# Altium schematic sheet Digital.SchDoc
size 840 x 594 mm
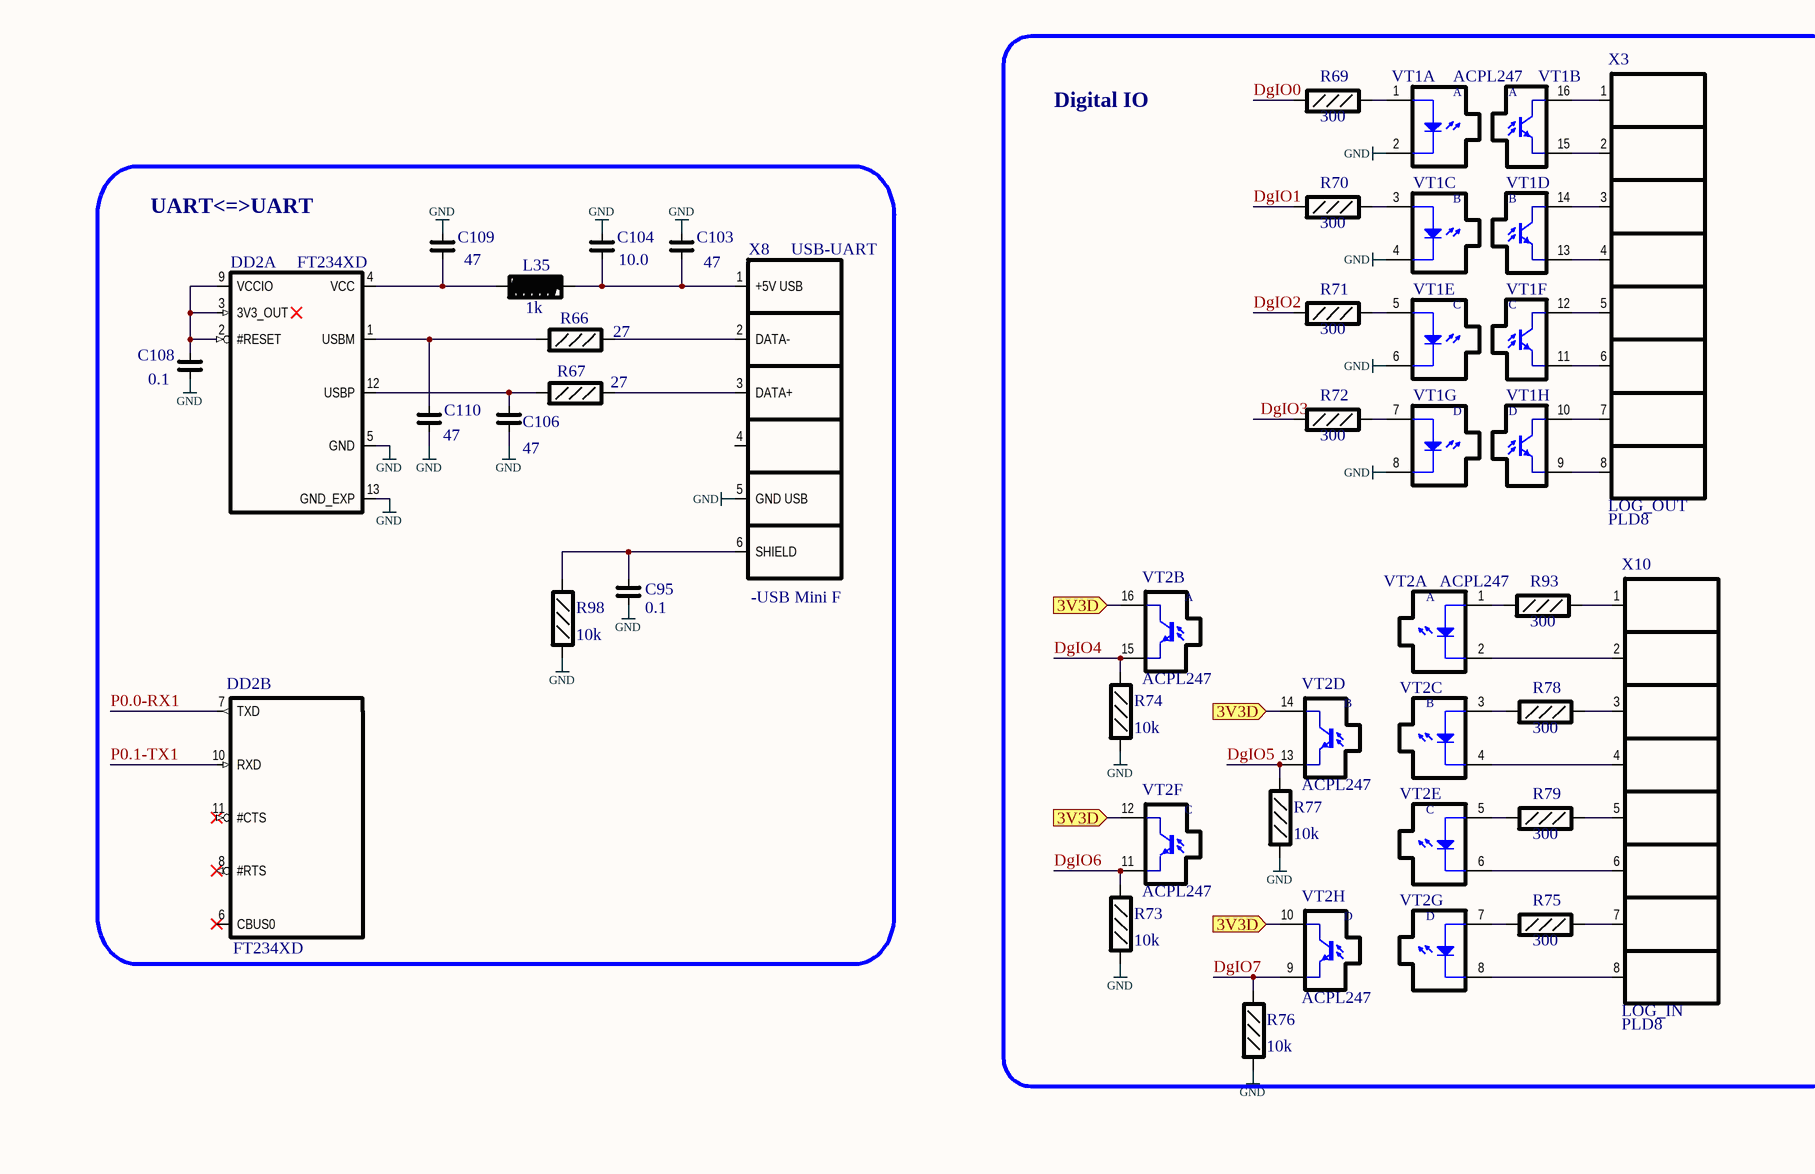
[diagram p0: Digital.SchDoc, top left]
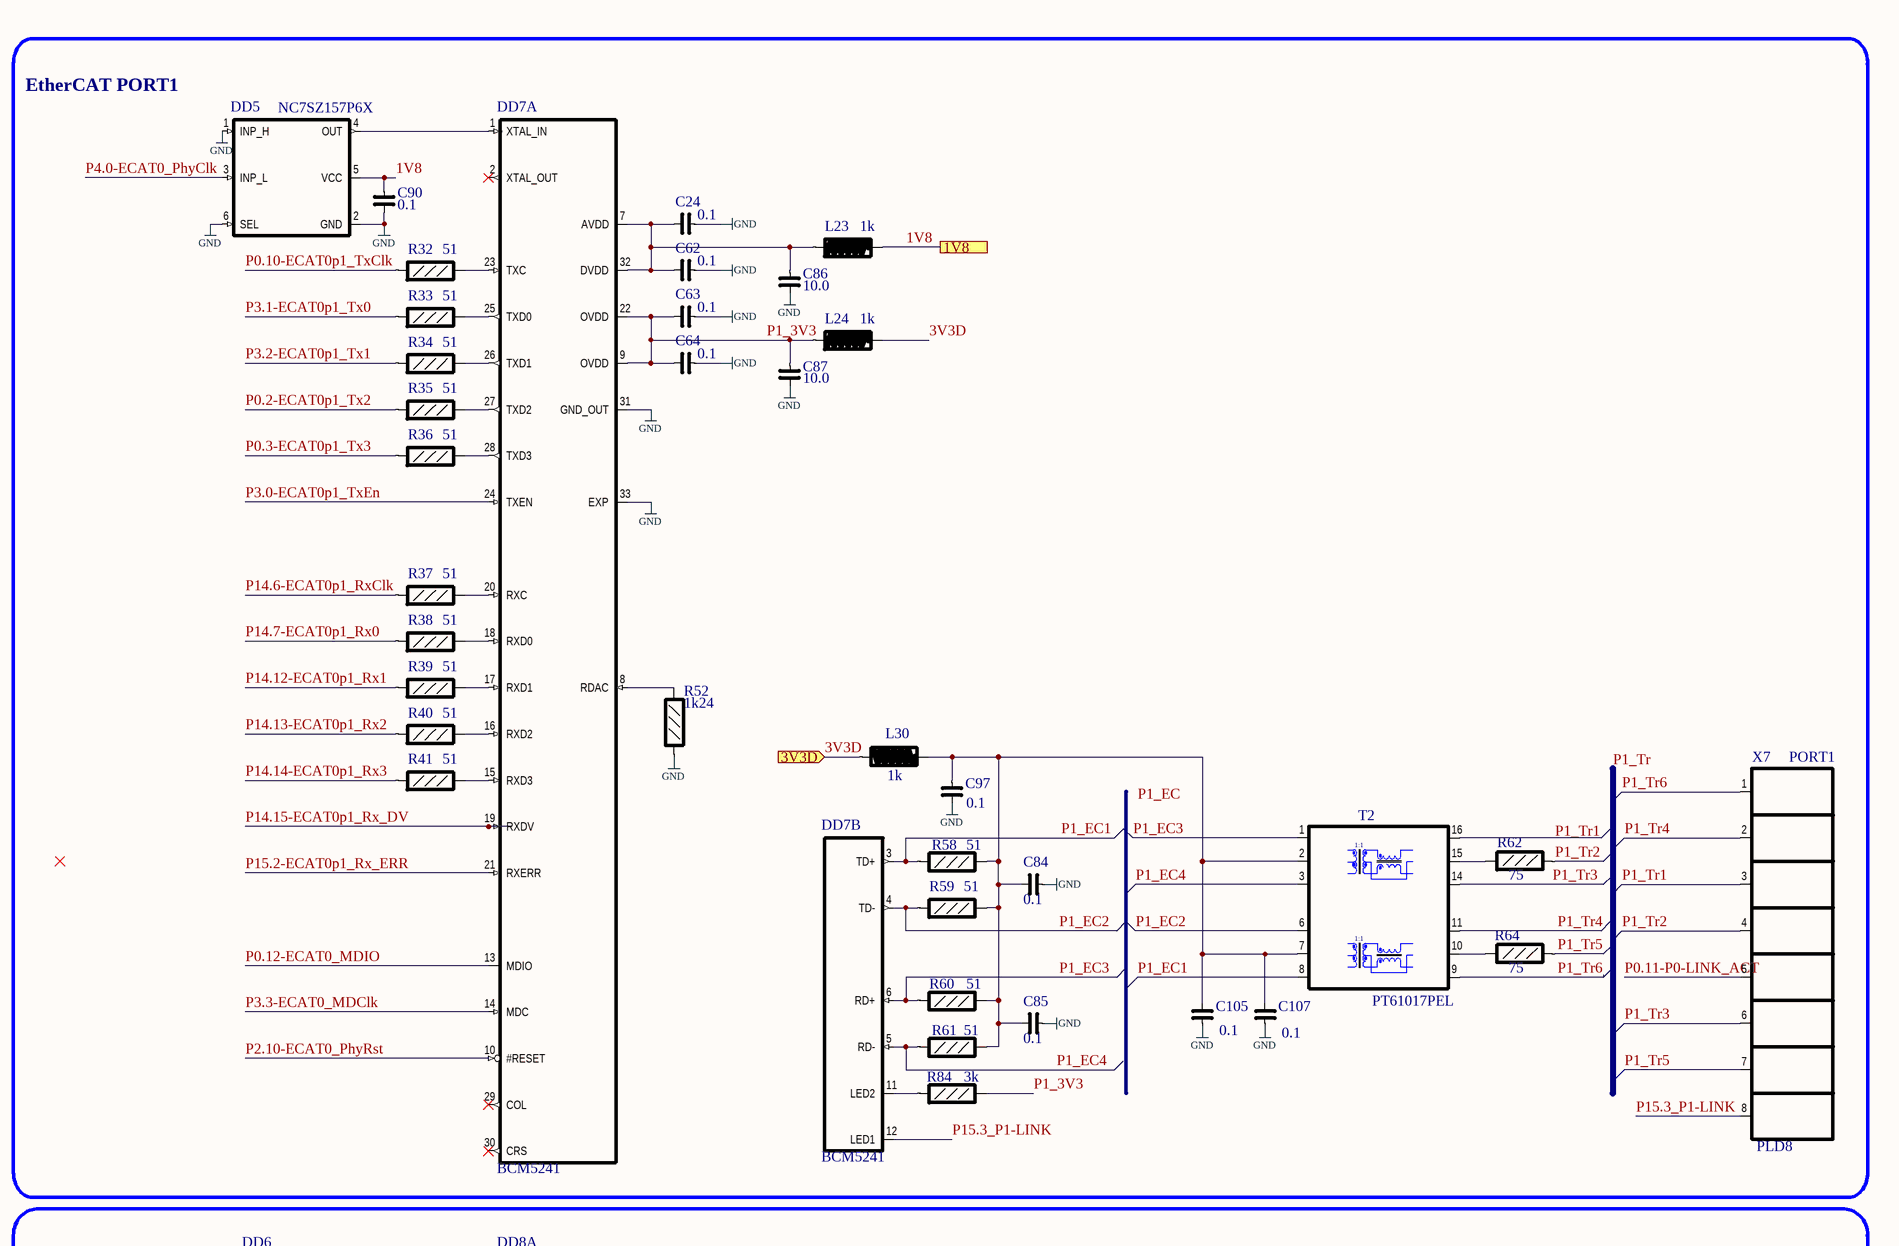
[diagram p1: Digital.SchDoc, top right]
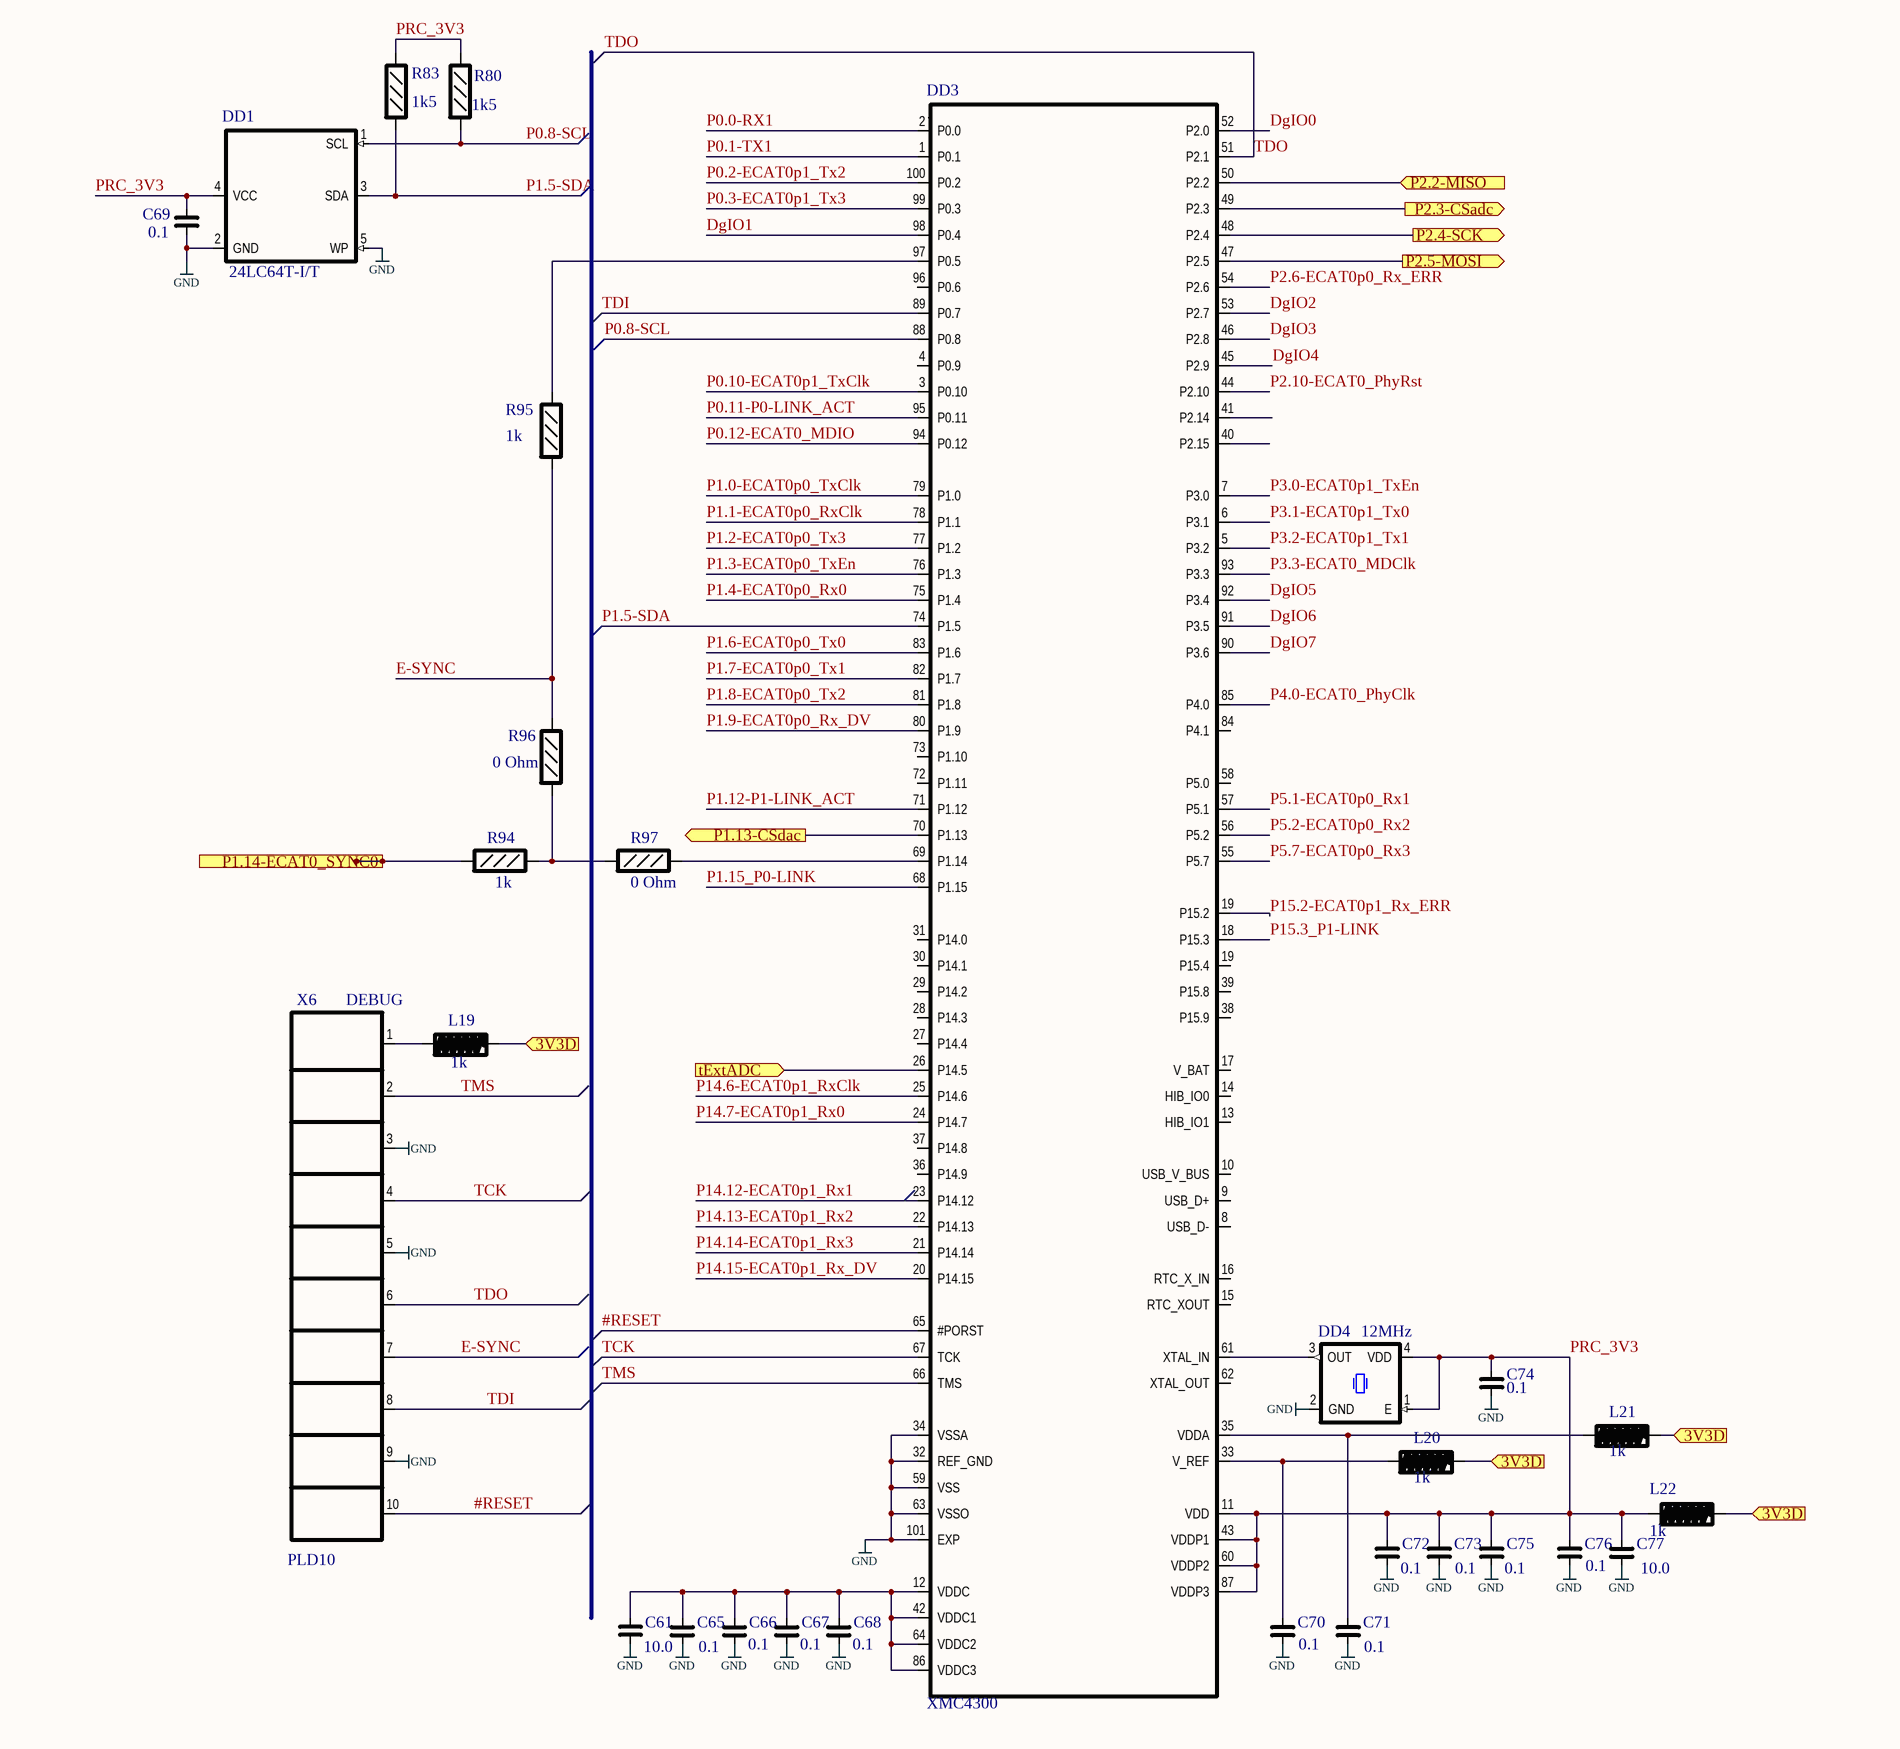
[diagram p2: Digital.SchDoc, bottom left]
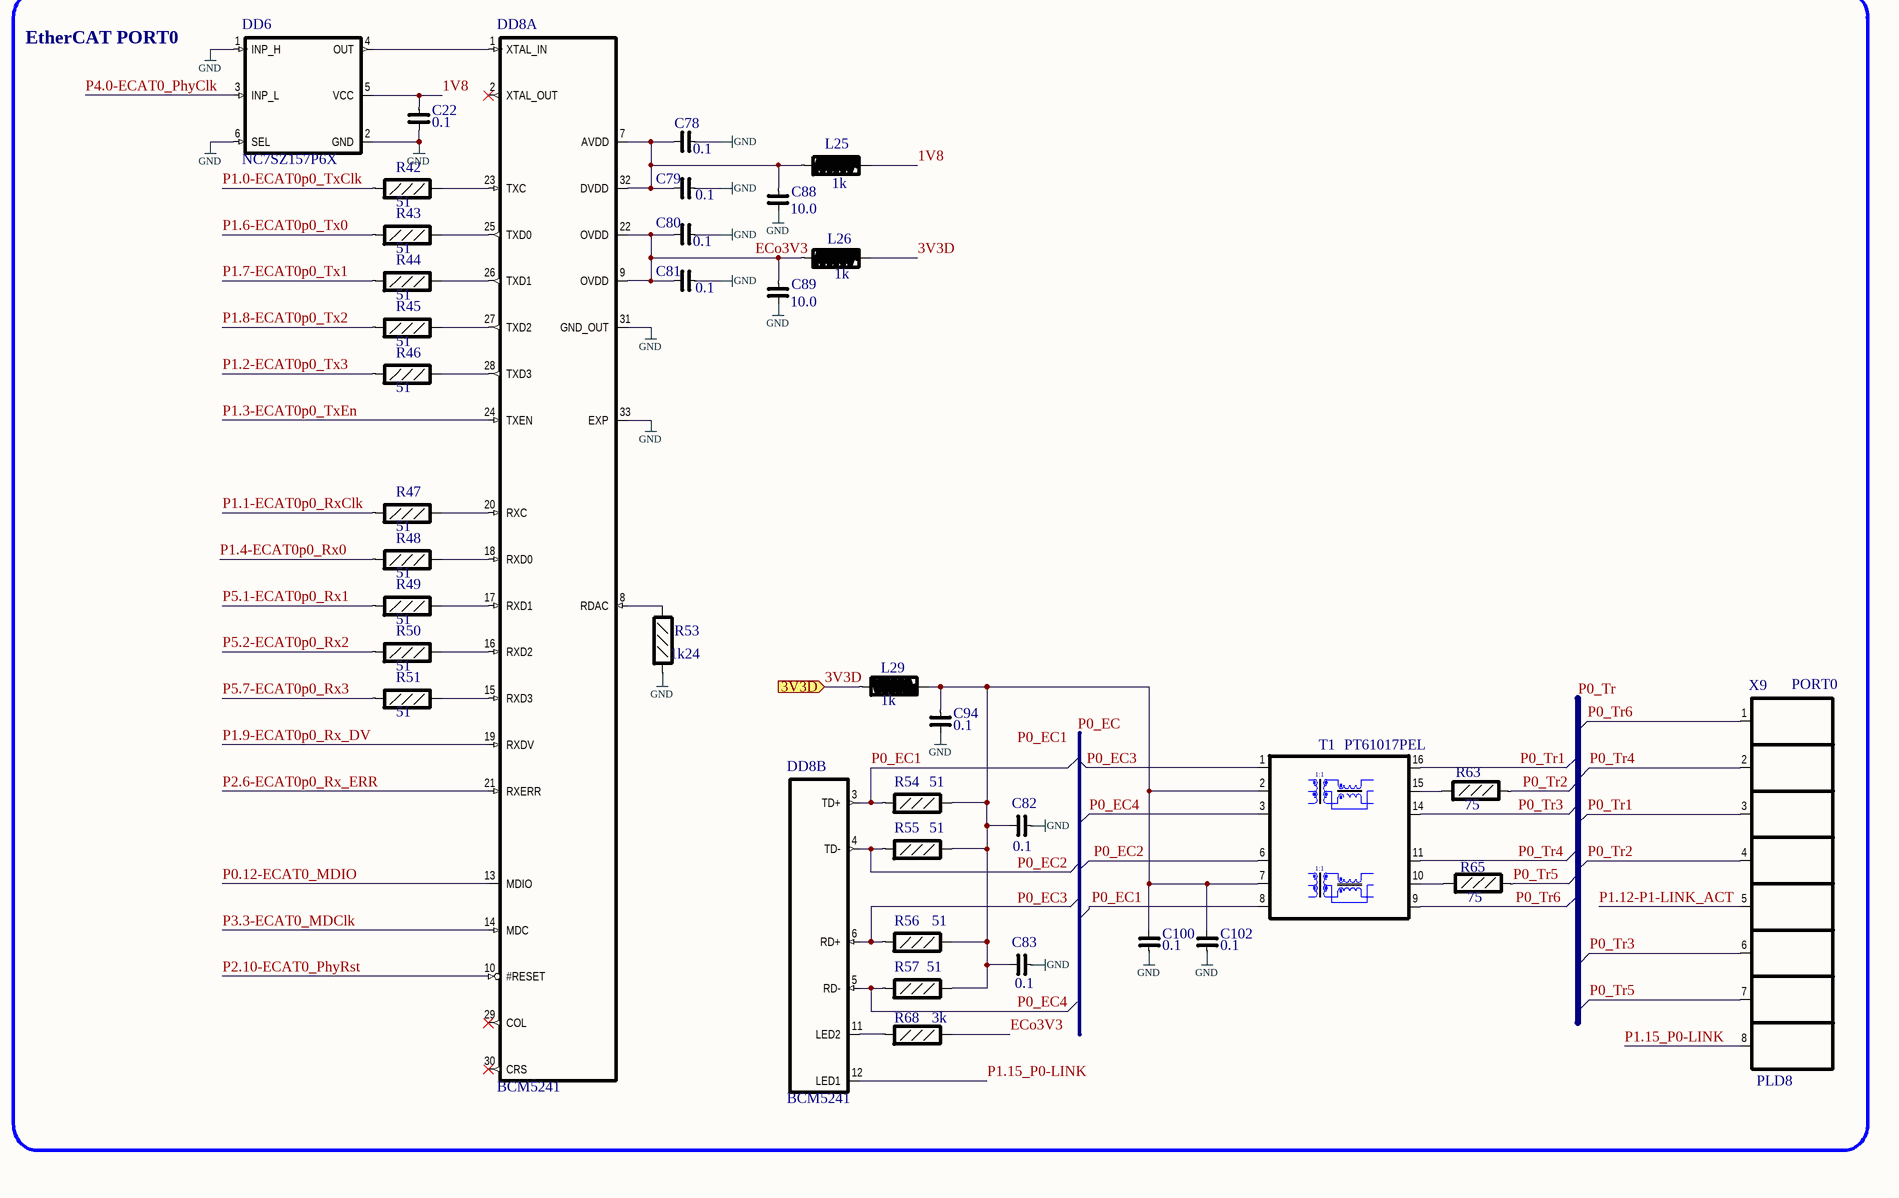
[diagram p3: Digital.SchDoc, bottom right]

## Parts
C22  0.1  [CAPC1608X85N]
C24  0.1  [CAPC1608X85N]
C61  10.0  [CAPC2012X135N]
C62  0.1  [CAPC1608X85N]
C63  0.1  [CAPC1608X85N]
C64  0.1  [CAPC1608X85N]
C65  0.1  [CAPC1608X85N]
C66  0.1  [CAPC1608X85N]
C67  0.1  [CAPC1608X85N]
C68  0.1  [CAPC1608X85N]
C69  0.1  [CAPC1608X85N]
C70  0.1  [CAPC1608X85N]
C71  0.1  [CAPC1608X85N]
C72  0.1  [CAPC1608X85N]
C73  0.1  [CAPC1608X85N]
C74  0.1  [CAPC1608X85N]
C75  0.1  [CAPC1608X85N]
C76  0.1  [CAPC1608X85N]
C77  10.0  [CAPC2012X135N]
C78  0.1  [CAPC1608X85N]
C79  0.1  [CAPC1608X85N]
C80  0.1  [CAPC1608X85N]
C81  0.1  [CAPC1608X85N]
C82  0.1  [CAPC1608X85N]
C83  0.1  [CAPC1608X85N]
C84  0.1  [CAPC1608X85N]
C85  0.1  [CAPC1608X85N]
C86  10.0  [CAPC2012X135N]
C87  10.0  [CAPC2012X135N]
C88  10.0  [CAPC2012X135N]
C89  10.0  [CAPC2012X135N]
C90  0.1  [CAPC1608X85N]
C94  0.1  [CAPC1608X85N]
C95  0.1  [CAPC1608X85N]
C97  0.1  [CAPC1608X85N]
C100  0.1  [CAPC1608X85N]
C102  0.1  [CAPC1608X85N]
C103  47  [CAPC1608X85N]
C104  10.0  [CAPC2012X135N]
C105  0.1  [CAPC1608X85N]
C106  47  [CAPC1608X85N]
C107  0.1  [CAPC1608X85N]
C108  0.1  [CAPC1608X85N]
C109  47  [CAPC1608X85N]
C110  47  [CAPC1608X85N]
DD1  24LC64T-I/T  [SOT23_5-095]
DD2  FT234XD  [DFN_12-045]  (parts A,B of 2)
DD3  XMC4300  [LQFP100-50]
DD4  12MHz  [SO_4-1.7]
DD5  NC7SZ157P6X  [SC70_6-065]
DD6  NC7SZ157P6X  [SC70_6-065]
DD7  BCM5241  [QFN_33-50]  (parts A,B of 2)
DD8  BCM5241  [QFN_33-50]  (parts A,B of 2)
L19  1k  [RESC2012X50N]
L20  1k  [RESC2012X50N]
L21  1k  [RESC2012X50N]
L22  1k  [RESC2012X50N]
L23  1k  [RESC2012X50N]
L24  1k  [RESC2012X50N]
L25  1k  [RESC2012X50N]
L26  1k  [RESC2012X50N]
L29  1k  [RESC2012X50N]
L30  1k  [RESC2012X50N]
L35  1k  [RESC2012X50N]
R32  51  [RESC1608X50N]
R33  51  [RESC1608X50N]
R34  51  [RESC1608X50N]
R35  51  [RESC1608X50N]
R36  51  [RESC1608X50N]
R37  51  [RESC1608X50N]
R38  51  [RESC1608X50N]
R39  51  [RESC1608X50N]
R40  51  [RESC1608X50N]
R41  51  [RESC1608X50N]
R42  51  [RESC1608X50N]
R43  51  [RESC1608X50N]
R44  51  [RESC1608X50N]
R45  51  [RESC1608X50N]
R46  51  [RESC1608X50N]
R47  51  [RESC1608X50N]
R48  51  [RESC1608X50N]
R49  51  [RESC1608X50N]
R50  51  [RESC1608X50N]
R51  51  [RESC1608X50N]
R52  1k24  [RESC1608X50N]
R53  1k24  [RESC1608X50N]
R54  51  [RESC1608X50N]
R55  51  [RESC1608X50N]
R56  51  [RESC1608X50N]
R57  51  [RESC1608X50N]
R58  51  [RESC1608X50N]
R59  51  [RESC1608X50N]
R60  51  [RESC1608X50N]
R61  51  [RESC1608X50N]
R62  75  [RESC1608X50N]
R63  75  [RESC1608X50N]
R64  75  [RESC1608X50N]
R65  75  [RESC1608X50N]
R66  27  [RESC1608X50N]
R67  27  [RESC1608X50N]
R68  3k  [RESC1608X50N]
R69  300  [RESC1608X50N]
R70  300  [RESC1608X50N]
R71  300  [RESC1608X50N]
R72  300  [RESC1608X50N]
R73  10k  [RESC1608X50N]
R74  10k  [RESC1608X50N]
R75  300  [RESC1608X50N]
R76  10k  [RESC1608X50N]
R77  10k  [RESC1608X50N]
R78  300  [RESC1608X50N]
R79  300  [RESC1608X50N]
R80  1k5  [RESC1608X50N]
R83  1k5  [RESC1608X50N]
R84  3k  [RESC1608X50N]
R93  300  [RESC1608X50N]
R94  1k  [RESC1608X50N]
R95  1k  [RESC1608X50N]
R96  0 Ohm  [RESC1608X50N]
R97  0 Ohm  [RESC1608X50N]
R98  10k  [RESC1608X50N]
T1  PT61017PEL  [SOIC16-W-]
T2  PT61017PEL  [SOIC16-W-]
VT1  ACPL247  [SOIC_16-127]  (parts A,B,C,D,E,F,G,H of 8)
VT2  ACPL247  [SOIC_16-127]  (parts A,B,C,D,E,F,G,H of 8)
X3  LOG_OUT  [DIP_8-254_WO_CASE]
X6  DEBUG  [DIP_10-254_WO_CASE]
X7  PORT1  [DIP_8-254_WO_CASE]
X8  USB-UART  Device: -USB Mini F  [TYCO_1734035-1]
X9  PORT0  [DIP_8-254_WO_CASE]
X10  LOG_IN  [DIP_8-254_WO_CASE]

## Blocks framed on the sheet
Digital IO: R69-R79 R93 VT1 VT2 X3 X10
EtherCAT PORT1: C24 C62-C64 C84-C87 C90 C97 C105 C107 DD5 DD7 L23 L24 L30 R32-R41 R52 R58-R62 R64 R84 T2 X7
UART<=>UART: C95 C103 C104 C106 C108-C110 DD2 L35 R66 R67 R98 X8
EtherCAT PORT0: C22 C78-C83 C88 C89 C94 C100 C102 DD6 DD8 L25 L26 L29 R42-R51 R53-R57 R63 R65 R68 T1 X9

## Ports
1V8, 3V3D (in), P1.13-CSdac (out), P1.14-ECAT0_SYNC0 (out), P2.2-MISO (in), P2.3-CSadc (out), P2.4-SCK (out), P2.5-MOSI (out), tExtADC (in)

## Nets
GND: C22.1 C24.2 C61.1 C62.2 C63.2 C64.2 C65.2 C66.2 C67.2 C68.2 C69.1 C70.2 C71.2 C72.2 C73.2 C74.2 C75.2 C76.2 C77.1 C78.2 C79.2 C80.2 C81.2 C82.2 C83.2 C84.2 C85.2 C86.1 C87.1 C88.1 C89.1 C90.1 C94.1 C95.1 C97.1 C100.2 C102.2 C103.2 C104.2 C105.2 C106.1 C107.2 C108.1 C109.2 C110.1 DD1.2(GND) DD1.5(WP) DD2.5(GND) DD2.13(GND_EXP) DD3.32(REF_GND) DD3.34(VSSA) DD3.59(VSS) DD3.63(VSSO) DD3.101(EXP) DD4.2(GND) DD5.1(INP_H) DD5.2(GND) DD5.6(SEL) DD6.1(INP_H) DD6.2(GND) DD6.6(SEL) DD7.31(GND_OUT) DD7.33(EXP) DD8.31(GND_OUT) DD8.33(EXP) R52.1 R53.1 R73.1 R74.1 R76.1 R77.1 R98.1 VT1.2(C) VT1.4(C) VT1.6(C) VT1.8(C) X6.3 X6.5 X6.9 X8.5(GND_USB)
1V8: C22.2 C90.2 DD5.5(VCC) DD6.5(VCC) L23.2 L25.2 ; port 1V8
3V3D: L19.2 L20.2 L21.2 L22.2 L24.2 L26.2 L29.1 L30.1 VT2.10(C) VT2.12(C) VT2.14(C) VT2.16(C) ; port 3V3D
#RESET: DD3.65(#PORST) X6.10
DgIO0: DD3.52(P2.0) R69.1
DgIO1: DD3.98(P0.4) R70.1
DgIO2: DD3.53(P2.7) R71.1
DgIO3: DD3.46(P2.8) R72.1
DgIO4: DD3.45(P2.9) R74.2 VT2.15(E)
DgIO5: DD3.92(P3.4) R77.2 VT2.13(E)
DgIO6: DD3.91(P3.5) R73.2 VT2.11(E)
DgIO7: DD3.90(P3.6) R76.2 VT2.9(E)
E-SYNC: R95.2 R96.1 X6.7
ECo3V3: C80.1 C81.1 C89.2 DD8.9(OVDD) DD8.22(OVDD) L26.1 R68.2
P0.0-RX1: DD2.7(TXD) DD3.2(P0.0)
P0.1-TX1: DD2.10(RXD) DD3.1(P0.1)
P0.2-ECAT0p1_Tx2: DD3.100(P0.2) R35.1
P0.3-ECAT0p1_Tx3: DD3.99(P0.3) R36.1
P0.8-SCL: DD1.1(SCL) DD3.88(P0.8) R80.2
P0.10-ECAT0p1_TxClk: DD3.3(P0.10) R32.1
P0.11-P0-LINK_ACT: DD3.95(P0.11) X7.5
P0.12-ECAT0_MDIO: DD3.94(P0.12) DD7.13(MDIO) DD8.13(MDIO)
P0_EC1: DD8.3(TD+) R54.1 T1.8(i2-3)
P0_EC2: DD8.4(TD-) R55.1 T1.6(i2-1)
P0_EC3: DD8.6(RD+) R56.1 T1.1(i1-1)
P0_EC4: DD8.5(RD-) R57.1 T1.3(i3-3)
P0_Tr1: T1.16(o1-1) X9.3
P0_Tr2: R63.1 X9.4
P0_Tr3: T1.14(o1-3) X9.6
P0_Tr4: T1.11(o2-1) X9.2
P0_Tr5: R65.1 X9.7
P0_Tr6: T1.9(o2-3) X9.1
P1.0-ECAT0p0_TxClk: DD3.79(P1.0) R42.1
P1.1-ECAT0p0_RxClk: DD3.78(P1.1) R47.1
P1.2-ECAT0p0_Tx3: DD3.77(P1.2) R46.1
P1.3-ECAT0p0_TxEn: DD3.76(P1.3) DD8.24(TXEN)
P1.4-ECAT0p0_Rx0: DD3.75(P1.4) R48.1
P1.5-SDA: DD1.3(SDA) DD3.74(P1.5) R83.1
P1.6-ECAT0p0_Tx0: DD3.83(P1.6) R43.1
P1.7-ECAT0p0_Tx1: DD3.82(P1.7) R44.1
P1.8-ECAT0p0_Tx2: DD3.81(P1.8) R45.1
P1.9-ECAT0p0_Rx_DV: DD3.80(P1.9) DD8.19(RXDV)
P1.12-P1-LINK_ACT: DD3.71(P1.12) X9.5
P1.13-CSdac: DD3.70(P1.13) ; port P1.13-CSdac
P1.14-ECAT0_SYNC0: R94.2 ; port P1.14-ECAT0_SYNC0
P1.15_P0-LINK: DD3.68(P1.15) DD8.12(LED1) X9.8
P1_3V3: C63.1 C64.1 C87.2 DD7.9(OVDD) DD7.22(OVDD) L24.1 R84.2
P1_EC1: DD7.3(TD+) R58.1 T2.8(i2-3)
P1_EC2: DD7.4(TD-) R59.1 T2.6(i2-1)
P1_EC3: DD7.6(RD+) R60.1 T2.1(i1-1)
P1_EC4: DD7.5(RD-) R61.1 T2.3(i3-3)
P1_Tr1: X7.3
P1_Tr2: R62.1 X7.4
P1_Tr3: T2.14(o1-3) X7.6
P1_Tr4: T2.11(o2-1) X7.2
P1_Tr5: R64.1 X7.7
P1_Tr6: T2.9(o2-3) X7.1
P2.2-MISO: DD3.50(P2.2) ; port P2.2-MISO
P2.3-CSadc: DD3.49(P2.3) ; port P2.3-CSadc
P2.4-SCK: DD3.48(P2.4) ; port P2.4-SCK
P2.5-MOSI: DD3.47(P2.5) ; port P2.5-MOSI
P2.6-ECAT0p0_Rx_ERR: DD3.54(P2.6) DD8.21(RXERR)
P2.10-ECAT0_PhyRst: DD3.44(P2.10) DD7.10(#RESET) DD8.10(#RESET)
P3.0-ECAT0p1_TxEn: DD3.7(P3.0) DD7.24(TXEN)
P3.1-ECAT0p1_Tx0: DD3.6(P3.1) R33.1
P3.2-ECAT0p1_Tx1: DD3.5(P3.2) R34.1
P3.3-ECAT0_MDClk: DD3.93(P3.3) DD7.14(MDC) DD8.14(MDC)
P4.0-ECAT0_PhyClk: DD3.85(P4.0) DD5.3(INP_L) DD6.3(INP_L)
P5.1-ECAT0p0_Rx1: DD3.57(P5.1) R49.1
P5.2-ECAT0p0_Rx2: DD3.56(P5.2) R50.1
P5.7-ECAT0p0_Rx3: DD3.55(P5.7) R51.1
P14.6-ECAT0p1_RxClk: DD3.25(P14.6) R37.1
P14.7-ECAT0p1_Rx0: DD3.24(P14.7) R38.1
P14.12-ECAT0p1_Rx1: DD3.23(P14.12) R39.1
P14.13-ECAT0p1_Rx2: DD3.22(P14.13) R40.1
P14.14-ECAT0p1_Rx3: DD3.21(P14.14) R41.1
P14.15-ECAT0p1_Rx_DV: DD3.20(P14.15) DD7.19(RXDV)
P15.2-ECAT0p1_Rx_ERR: DD3.19(P15.4) DD7.21(RXERR)
P15.3_P1-LINK: DD3.18(P15.3) DD7.12(LED1) X7.8
PRC_3V3: C69.2 C72.1 C73.1 C74.1 C75.1 C76.1 C77.2 DD1.4(VCC) DD3.11(VDD) DD3.43(VDDP1) DD3.60(VDDP2) DD3.87(VDDP3) DD4.1(E) DD4.4(VDD) L22.1 R80.1 R83.2
TCK: DD3.67(TCK) X6.4
TDI: DD3.89(P0.7) X6.8
TDO: DD3.51(P2.1) X6.6
tExtADC: DD3.26(P14.5) ; port tExtADC
TMS: DD3.66(TMS) X6.2
NetC24_1: C24.1 C62.1 C86.2 DD7.7(AVDD) DD7.32(DVDD) L23.1
NetC61_2: C61.2 C65.1 C66.1 C67.1 C68.1 DD3.12(VDDC) DD3.42(VDDC1) DD3.64(VDDC2) DD3.86(VDDC3)
NetC70_1: C70.1 DD3.33(V_REF) L20.1
NetC71_1: C71.1 DD3.35(VDDA) L21.1
NetC78_1: C78.1 C79.1 C88.2 DD8.7(AVDD) DD8.32(DVDD) L25.1
NetC82_1: C82.1 C83.1 C94.2 C100.1 C102.1 L29.2 R54.2 R55.2 R56.2 R57.2 T1.2(i2-2) T1.7(i2-2)
NetC84_1: C84.1 C85.1 C97.2 C105.1 C107.1 L30.2 R58.2 R59.2 R60.2 R61.2 T2.2(i2-2) T2.7(i2-2)
NetC95_2: C95.2 R98.2 X8.6(SHIELD)
NetC103_1: C103.1 C104.1 L35.2 X8.1(+5V_USB)
NetC106_2: C106.2 DD2.12(USBP) R67.1
NetC108_2: C108.2 DD2.2(#RESET) DD2.3(3V3_OUT) DD2.9(VCCIO)
NetC109_1: C109.1 DD2.4(VCC) L35.1
NetC110_2: C110.2 DD2.1(USBM) R66.1
NetDD3_61: DD3.61(XTAL_IN) DD4.3(OUT)
NetDD3_69: DD3.69(P1.14) R97.1
NetDD3_97: DD3.97(P0.5) R95.1
NetDD5_4: DD5.4(OUT) DD7.1(XTAL_IN)
NetDD6_4: DD6.4(OUT) DD8.1(XTAL_IN)
NetDD7_8: DD7.8(RDAC) R52.2
NetDD7_11: DD7.11(LED2) R84.1
NetDD7_15: DD7.15(RXD3) R41.2
NetDD7_16: DD7.16(RXD2) R40.2
NetDD7_17: DD7.17(RXD1) R39.2
NetDD7_18: DD7.18(RXD0) R38.2
NetDD7_20: DD7.20(RXC) R37.2
NetDD7_23: DD7.23(TXC) R32.2
NetDD7_25: DD7.25(TXD0) R33.2
NetDD7_26: DD7.26(TXD1) R34.2
NetDD7_27: DD7.27(TXD2) R35.2
NetDD7_28: DD7.28(TXD3) R36.2
NetDD8_8: DD8.8(RDAC) R53.2
NetDD8_11: DD8.11(LED2) R68.1
NetDD8_15: DD8.15(RXD3) R51.2
NetDD8_16: DD8.16(RXD2) R50.2
NetDD8_17: DD8.17(RXD1) R49.2
NetDD8_18: DD8.18(RXD0) R48.2
NetDD8_20: DD8.20(RXC) R47.2
NetDD8_23: DD8.23(TXC) R42.2
NetDD8_25: DD8.25(TXD0) R43.2
NetDD8_26: DD8.26(TXD1) R44.2
NetDD8_27: DD8.27(TXD2) R45.2
NetDD8_28: DD8.28(TXD3) R46.2
NetL19_1: L19.1 X6.1
NetR62_2: R62.2 T2.15(o1-2)
NetR63_2: R63.2 T1.15(o1-2)
NetR64_2: R64.2 T2.10(o2-2)
NetR65_2: R65.2 T1.10(o2-2)
NetR66_2: R66.2 X8.2(DATA-)
NetR67_2: R67.2 X8.3(DATA+)
NetR69_2: R69.2 VT1.1(A)
NetR70_2: R70.2 VT1.3(A)
NetR71_2: R71.2 VT1.5(A)
NetR72_2: R72.2 VT1.7(A)
NetR75_1: R75.1 VT2.7(A)
NetR75_2: R75.2 X10.7
NetR78_1: R78.1 VT2.3(A)
NetR78_2: R78.2 X10.3
NetR79_1: R79.1 VT2.5(A)
NetR79_2: R79.2 X10.5
NetR93_1: R93.1 VT2.1(A)
NetR93_2: R93.2 X10.1
NetR94_1: R94.1 R96.2 R97.2
NetVT1_9: VT1.9(E) X3.8
NetVT1_10: VT1.10(C) X3.7
NetVT1_11: VT1.11(E) X3.6
NetVT1_12: VT1.12(C) X3.5
NetVT1_13: VT1.13(E) X3.4
NetVT1_14: VT1.14(C) X3.3
NetVT1_15: VT1.15(E) X3.2
NetVT1_16: VT1.16(C) X3.1
NetVT2_2: VT2.2(C) X10.2
NetVT2_4: VT2.4(C) X10.4
NetVT2_6: VT2.6(C) X10.6
NetVT2_8: VT2.8(C) X10.8

Not connected (* = marked no-connect by the designer): DD2 6(CBUS0)* 8(#RTS)* 11(#CTS)*; DD3 4(P0.9) 8(USB_D-) 9(USB_D+) 10(USB_V_BUS) 13(HIB_IO1) 14(HIB_IO0) 15(RTC_XOUT) 16(RTC_X_IN) 17(V_BAT) 27(P14.4) 28(P14.3) 29(P14.2) 30(P14.1) 31(P14.0) 36(P14.9) 37(P14.8) 38(P15.9) 39(P15.8) 40(P2.15) 41(P2.14) 58(P5.0) 62(XTAL_OUT) 72(P1.11) 73(P1.10) 84(P4.1) 96(P0.6); DD7 2(XTAL_OUT)* 29(COL)* 30(CRS)*; DD8 2(XTAL_OUT)* 29(COL)* 30(CRS)*; T1 4(NC) 5(NC) 12(NC) 13(NC); T2 4(NC) 5(NC) 12(NC) 13(NC) 16(o1-1); X8 4

## Buses and harness runs
bus P0_Tr
bus P1_Tr

## Notes on the sheet
- Labels drawn without touching a wire or pin: P0_EC, P0_EC1, P1_EC, P1_Tr1
- Перв. примен.
- Справ. №
- Подп. и дата
- Инв. № дубл.
- Взам. инв. №
- Разраб.
- Изм.
- Лист
- № докум.
- Подп.
- Дата
- Лит.
- Масса
- Масштаб
- Пров.
- Т.контр.
- Листов
- Инв. № подл.
- Утв.
- Н.контр.
- Копировал
- Формат А1
- (in symbol ACPL247, part C) B
- (in symbol ACPL247, part D) B
- (in symbol ACPL247, part G) D
- (in symbol ACPL247, part H) D
- (in symbol PT61017PEL) 1:1

## Library data of the parts
C22 C24 C62-C64 C78-C85 C90 = CAP00603: Chip capasitor 0603; Vendor: Vishay; Unit Price: 0.1; Package: 0603; Value: 0.1
C61 C77 C86-C89 C104 = CAP0805: Chip capasitor 0805; Group: Passive; Vendor: Vishay; Unit Price: 0.1; Descr: Chip capasitor 0805; Package: SMD0805; Value: 10.0
C65-C76 C94 C95 C97 C100 C102 C103 C105-C110 = CAP00603: Chip capasitor 0603; Group: Passive; Vendor: Vishay; Unit Price: 0.1; Descr: Chip capasitor 0603; Package: 0603
  C65-C76 C94 C95 C97 C100 C102 C105 C107 C108: Value: 0.1
  C103 C106 C109 C110: Value: 47
DD1 = 24LC64T-I/OT: I2C EEPROM 64kbit; Vendor: Microchip; Package: SOT23-5; Unit Price: 1; Device: 24LC64T-I/T
DD2 = FT234XD: USB-UART driver; Vendor: FTDI; Paackage: DFN_12-0.45; Device: FT234XD; Unit Price: 2
DD4 = IQXO-793: Oscillator 4 pins 1=E/D 2=GND 3=OUT 4=VDD; Vendor: IQD; Package: SO 4 1.7; Unit Price: 3; Value: 12MHz
DD5 DD6 = NC7SZ157P6X: Digital multiplexer 2 to 1; Vendor: ON Semi; Package: SOT70-6; Unit Price: 0.2; Device: NC7SZ157P6X
DD7 DD8 = BCM5241: MII to Phy Ethernet T100 driver; Vendor: Broadcom; Package: ???; Unit Price: 2; Device: BCM5241
L19-L26 L29 L30 L35 = BLM21: SMD Ferrite beadr 0805; Vendor: Vishay; Unit Price: 0.1; Package: SMD0805; Value: 1k; Device: BLM21
R32-R80 R83 R84 R93-R98 = Res0603: Chip resistor 0603; Group: Passive; Vendor: Vishay; Unit Price: 0.005; Descr: Chip resistor 0603; Package: SMD0603
  R32-R51 R54-R61: Value: 51
  R52 R53: Value: 1k24
  R62-R65: Value: 75
  R66 R67: Value: 27
  R68 R84: Value: 3k
  R69-R72 R75 R78 R79 R93: Value: 300
  R73 R74 R76 R77 R98: Value: 10k
  R80 R83: Value: 1k5
  R94 R95: Value: 1k
  R96 R97: Value: 0 Ohm
T1 T2 = PT61017PEL: 10/100BASE-T Single Port LAN Transformer Module
VT1 VT2 = ACPL247: Quad transistor optocoupler; Vendor: Avago; Package: SOIC16; Unit Price: 2; Device: ACPL247
X3 X7 X9 X10 = PLD8: 8 pin TRH connector 2.54mm pitch; Vendor: Connfly; Pckage: DIP8- 2.54; Unit Price: 0.2; Device: PLD8
  X3: Value: LOG_OUT
  X7: Value: PORT1
  X9: Value: PORT0
  X10: Value: LOG_IN
X6 = PLD10: 10 pin TRH connector 2.54mm pitch; Vendor: Connfly; Pckage: DIP10- 2.54; Unit Price: 0.2; Value: DEBUG; Device: PLD10
X8 = USBMiniF: USB mini 6 pin SMD connector  TYCO_1734035-1; Vendor: TYCO; Unit Price: 1; Pckage: TYCO_1734035-1; Value: USB-UART